# Altium schematic sheet Reprogrammation.SchDoc
size A4; DrawnBy: Erwan MENARD; Revision: V0.1 Rev A; SheetNumber: 7; SheetTotal: 9
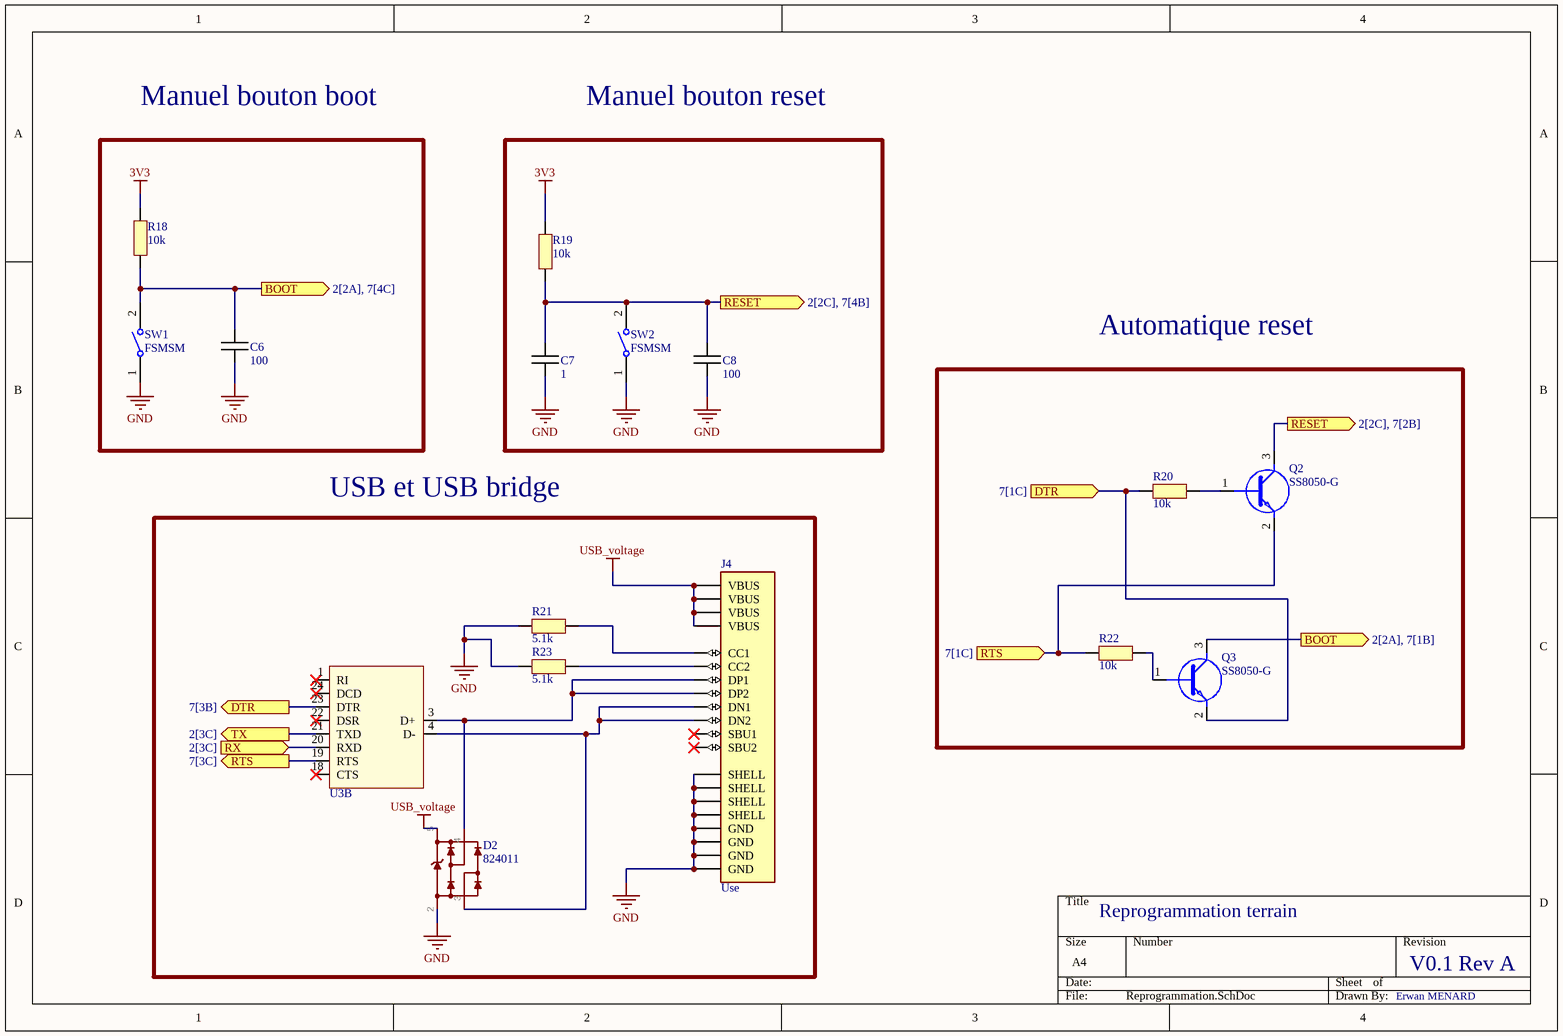
[diagram p0: Reprogrammation.SchDoc]

## Parts
C6  100  [CAPC1005X06N]
C7  1  [CAPC1005X06N]
C8  100  [CAPC1005X06N]
D2  824011  [824011]
J4  Use  [USB4085-GF-A]
Q2  SS8050-G  [SS8050-G]
Q3  SS8050-G  [SS8050-G]
R18  10k  [RESC1005X06N]
R19  10k  [RESC1005X06N]
R20  10k  [RESC1005X06N]
R21  5.1k  [RESC1005X06N]
R22  10k  [RESC1005X06N]
R23  5.1k  [RESC1005X06N]
SW1  FSMSM  [TECO-FSMSM-2_V]
SW2  FSMSM  [TECO-FSMSM-2_V]
U3  CP2104-F03-GM  [PQFN50P400X400X80_HS-25N]  (value not drawn)  (part B of 2)

## Blocks framed on the sheet
USB et USB bridge: D2 J4 R21 R23 U3

## Ports
BOOT (out, see 2[2A], 7[1B]), BOOT (out, see 2[2A], 7[4C]), DTR (in, see 7[1C]), DTR (out, see 7[3B]), RESET (out, see 2[2C], 7[2B]), RESET (out, see 2[2C], 7[4B]), RTS (in, see 7[1C]), RTS (out, see 7[3C]), RX (in, see 2[3C]), TX (out, see 2[3C])

## Nets
3V3: R18.2 R19.2
GND: C6.2 C7.2 C8.2 D2.2(GND) J4.A1(GND) J4.A12(GND) J4.B1(GND) J4.B12(GND) J4.S1(SHELL) J4.S2(SHELL) J4.S3(SHELL) J4.S4(SHELL) R21.1 R23.1 SW1.1 SW2.1
USB_voltage: D2.5(VDD) J4.A4(VBUS) J4.A9(VBUS) J4.B4(VBUS) J4.B9(VBUS)
BOOT: C6.1 Q3.3(C) R18.1 SW1.2 ; port BOOT
DTR: Q3.2(E) R20.2 U3.23(DTR) ; port DTR
RESET: C7.1 C8.1 Q2.3(C) R19.1 SW2.2 ; port RESET
RTS: Q2.2(E) R22.2 U3.19(RTS) ; port RTS
RX: U3.20(RXD) ; port RX
TX: U3.21(TXD) ; port TX
NetD2_3: D2.3 J4.A7(DN1) J4.B7(DN2) U3.4(D-)
NetD2_4: D2.4 J4.A6(DP1) J4.B6(DP2) U3.3(D+)
NetJ4_A5: J4.A5(CC1) R21.2
NetJ4_B5: J4.B5(CC2) R23.2
NetQ2_1: Q2.1(B) R20.1
NetQ3_1: Q3.1(B) R22.1

Not connected (* = marked no-connect by the designer): J4 A8(SBU1)* B8(SBU2)*; U3 1(RI)* 18(CTS)* 22(DSR)* 24(DCD)*

## Notes on the sheet
- Manuel bouton boot
- Manuel bouton reset
- Automatique reset
- Reprogrammation terrain

## Library data of the parts
C6-C8 = Capacitor
D2 = 824011: TVS Diode Array WE-TVS, High Speed Series  - Low capazity - No leakage current - Low clamping voltage - high ESD voltage protection  -- USB 1.0 - 2.0
J4 = USB4085-GF-A: Connecteurs USB USB Type C, 2.0, Rec, TH , G/F, RA , Top Mnt, T & R
Q2 Q3 = SS8050-G: Bipolar Transistors - BJT NPN TRANSISTOR 1.5A 40V
R18-R23 = Resistor
SW1 SW2 = CMP-2000-07511-1: FSMSM Push Button Switch, 50 mA, -35 to 85 degC, 2-Pin SMD, RoHS, Bulk; Manufacturer: TE Connectivity; Actuator Length: 1.07mm; Electrical Life: 20000Cycles; Actuator Material: Polyamide; Current Rating: 50mA; Illumination Type: Illuminated; Voltage Rating (DC): 24V; Contact Resistance: 100mOhm; Case\/Package: SMD/SMT; Operating Force: 180gf; Switch Travel: 0.25mm; Max Voltage Rating (DC): 12V; Throw Configuration: SPST; Packaging: LoosePiece; Max Operating Temperature: 85degC; ELV: Compliant; Package Description: 2-Pin Surface Mount Device, Body 6 x 3.5 mm, Pitch 9.19 mm; RoHSCompliant: true; Manufacturer URL: http://www.te.com/; Contact Plating: Silver; Contact Material: Brass; Mounting Technology: SurfaceMount; Contact Current Rating: 50mA; Datasheet Version: Rev. C2, 08/2014; Datasheet URL: http://www.te.com/commerce/DocumentDelivery/DDEController?Action=showdoc&DocId=Customer+Drawing%7F1437566-3%7FC2%7Fpdf%7FEnglish%7FENG_CD_1437566-3_C2_1437566_3_1_c.dwg.pdf%7F1437566-3; Mechanical Life: 20000Cycles; Package Reference: FSMSM; REACH SVHC: Unknown; Orientation: Straight; Min Operating Temperature: -35degC; Lead Free: LeadFree; Termination: GullWing; Package Quantity: 1000; Mount: SurfaceMount
U3 = USBBridge: USB Bridge, USB to UART USB 2.0 UART Interface 24-QFN (4x4); Manufacturer 1: Silicon Labs; Supplier 1: Arrow Electronics; Supplier Part Number 1: CP2104-F03-GM; Manufacturer Part Number 1: CP2104-F03-GM